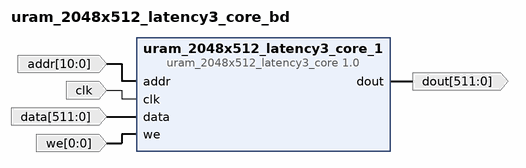
[diagram p0: block diagram of the top level]
# Vivado block design uram_2048x512_latency3_core_bd, xcvu9p-flga2104-1-e, Vivado 2019.1.3
create_bd_design uram_2048x512_latency3_core_bd

create_bd_port -dir I -from 10 -to 0 -type data addr
create_bd_port -dir I -type clk clk
create_bd_port -dir I -from 511 -to 0 -type data data
create_bd_port -dir O -from 511 -to 0 -type data dout
create_bd_port -dir I -from 0 -to 0 -type data we

create_bd_cell -type ip -vlnv User_Company:SysGen:uram_2048x512_latency3_core:1.0 uram_2048x512_latency3_core_1

# ---- connections ----

connect_bd_net [get_bd_ports addr] [get_bd_pins uram_2048x512_latency3_core_1/addr]
connect_bd_net [get_bd_ports clk] [get_bd_pins uram_2048x512_latency3_core_1/clk]
connect_bd_net [get_bd_ports data] [get_bd_pins uram_2048x512_latency3_core_1/data]
connect_bd_net [get_bd_pins uram_2048x512_latency3_core_1/dout] [get_bd_ports dout]
connect_bd_net [get_bd_ports we] [get_bd_pins uram_2048x512_latency3_core_1/we]

validate_bd_design
save_bd_design
